# EAGLE design DAU_Kupplung.brd_V1_6 (EAGLE 5.11)
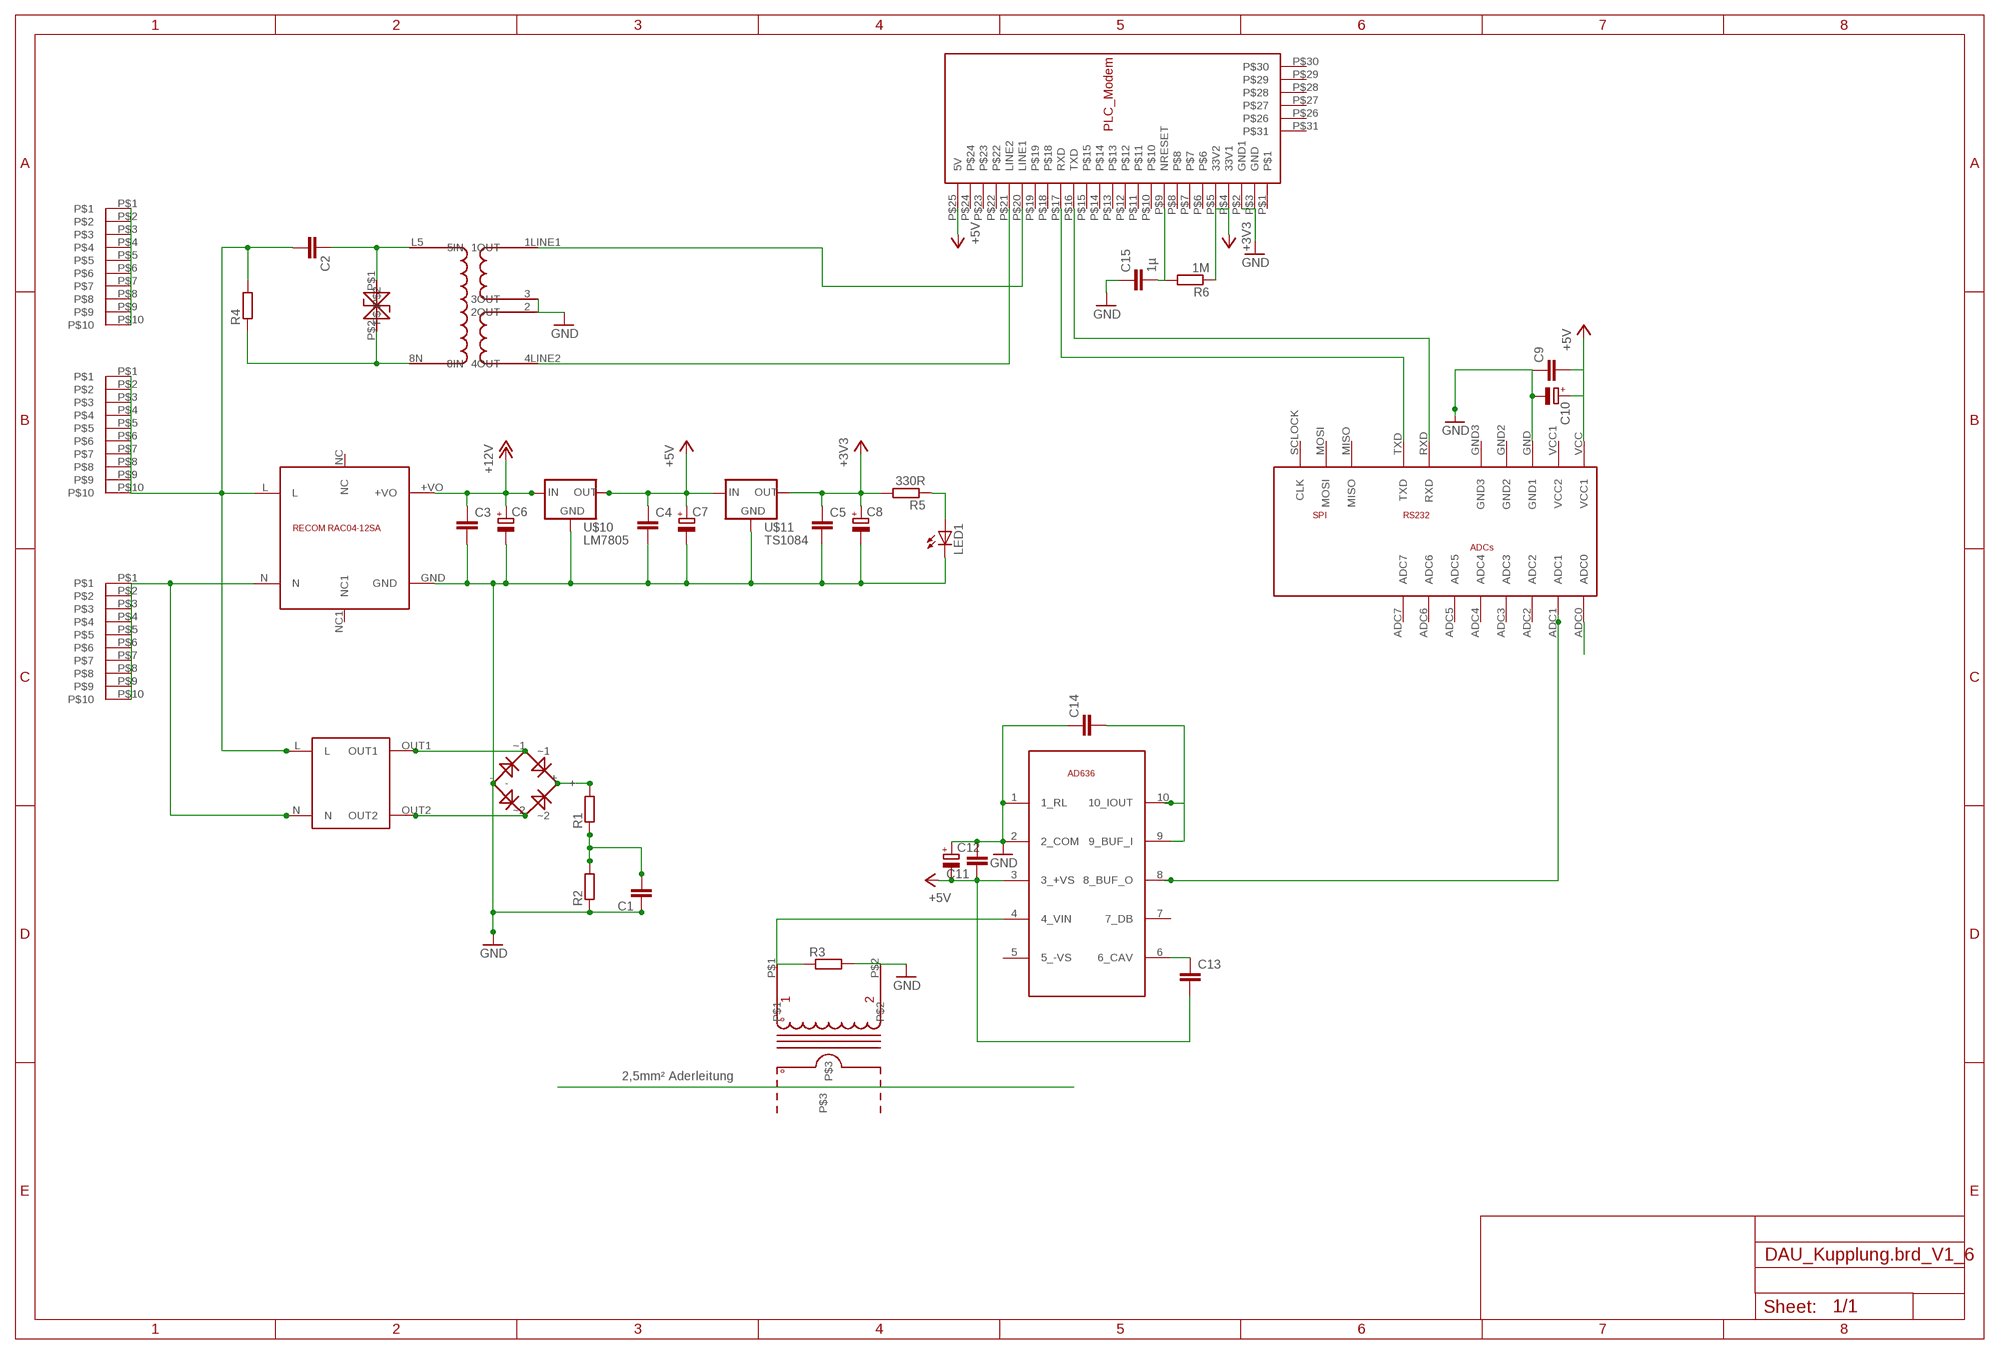
[diagram p0: schematic, sheet 1]

## Parts
C1  C2,5-3  [C2.5-3]
C2  C-EU225-087X268  [C225-087X268]
C3  C-EU025-040X050  [C025-040X050]
C4  C-EU025-040X050  [C025-040X050]
C5  C-EU025-040X050  [C025-040X050]
C6  CPOL-EUE2.5-6  [E2,5-6]
C7  CPOL-EUE2.5-6  [E2,5-6]
C8  CPOL-EUE2.5-6  [E2,5-6]
C9  C-EU025-040X050  [C025-040X050]
C10  CPOL-EUE2,5-6E  [E2,5-6E]
C11  C-EU025-040X050  [C025-040X050]
C12  CPOL-EUE2,5-6E  [E2,5-6E]
C13  C-EU025-040X050  [C025-040X050]
C14  C-EU025-040X050  [C025-040X050]
C15  1µ  C-EU025-040X050  [C025-040X050]
L  PRINT_CONNECTOR  [FASTON_DOUBLE]
LED1  LEDSQR2X5  [LED2X5]
N  PRINT_CONNECTOR  [FASTON_DOUBLE]
PE  PRINT_CONNECTOR  [FASTON_DOUBLE]
R1  R-EU_0204/7  [0204/7]
R2  R-EU_0204/7  [0204/7]
R3  R-EU_0204/7  [0204/7]
R4  R-EU_0204/7  [0204/7]
R5  330R  R-EU_0204/7  [0204/7]
R6  1M  R-EU_0204/7  [0204/7]
U$1  RECOM_RAC04_12SA  [RAC04_12SA]
U$2  SICHERHEITSTRAFO  [TRAFO_0,35VA]
U$3  ADUC831_MINIMUM  [ADUC_MINIMUM]
U$4  MODEMSTECKER  [MODEM_FUSS]
U$5  PLC_UEBERTRAGER_V2  [PLC-UEBERTRAGER_V2]
U$6  AC1010  [AC1010]
U$7  AD636  [TO100_10PIN]
U$8  RECTIFIER  [RECTIFIER]
U$9  SUPPRESSORDIODE15MM  [DIODE15_5MM]
U$10  LM7805  [LM7805]
U$11  TS1084  [TS1084]

## Nets
+3V3: C5.1 C8.+ R5.2 R6.1 U$4.P$4(33V1) U$4.P$5(33V2) U$11.2OUT(OUT)
+5V: C4.1 C7.+ C9.2 C10.+ C11.1 C12.- C13.2 U$3.VCC(VCC1) U$4.P$25(5V) U$7.3(3_+VS) U$10.OUT U$11.3IN(IN)
+12V: C3.1 C6.+ U$1.+VO U$10.IN
GND: C1.1 C3.2 C4.2 C5.2 C6.- C7.- C8.- C9.1 C10.- C11.2 C12.+ C14.1 C15.1 LED1.K(C) R2.1 R3.2 U$1.GND U$3.GND(GND1) U$4.P$2(GND1) U$4.P$3(GND) U$5.2(2OUT) U$5.3(3OUT) U$6.P$2 U$7.1(1_RL) U$7.2(2_COM) U$8.- U$10.GND U$11.1GND(GND)
N$2: R4.1 U$5.8N(8IN) U$9.P$2
N$3: U$2.OUT1 U$8.~1
N$4: U$2.OUT2 U$8.~2
N$5: U$4.P$20(LINE1) U$5.1LINE1(1OUT)
N$6: C1.2 R1.1 R2.2 U$3.ADC0
N$7: R1.2 U$8.+
N$8: R3.1 U$6.P$1 U$7.4(4_VIN)
N$10: N.P$1 N.P$2 N.P$3 N.P$4 N.P$5 N.P$6 N.P$7 N.P$8 N.P$9 N.P$10 U$1.N U$2.N
N$11: C2.1 U$5.L5(5IN) U$9.P$1
N$12: C2.2 L.P$1 L.P$2 L.P$3 L.P$4 L.P$5 L.P$6 L.P$7 L.P$8 L.P$9 L.P$10 R4.2 U$1.L U$2.L
N$13: U$4.P$21(LINE2) U$5.4LINE2(4OUT)
N$14: U$3.RXD U$4.P$16(TXD)
N$15: U$3.TXD U$4.P$17(RXD)
N$16: C14.2 U$7.9(9_BUF_I) U$7.10(10_IOUT)
N$17: C13.1 U$7.6(6_CAV)
N$18: U$3.ADC1 U$7.8(8_BUF_O)
N$19: LED1.A R5.1
N$20: C15.2 R6.2 U$4.P$9(NRESET)
N$22: PE.P$1 PE.P$2 PE.P$3 PE.P$4 PE.P$5 PE.P$6 PE.P$7 PE.P$8 PE.P$9 PE.P$10
Unconnected: U$1.NC U$1.NC1 U$3.ADC2 U$3.ADC3 U$3.ADC4 U$3.ADC5 U$3.ADC6 U$3.ADC7 U$3.GND2 U$3.GND3 U$3.MISO U$3.MOSI U$3.SCLOCK(CLK) U$3.VCC1(VCC2) U$4.P$1 U$4.P$6 U$4.P$7 U$4.P$8 U$4.P$10 U$4.P$11 U$4.P$12 U$4.P$13 U$4.P$14 U$4.P$15 U$4.P$18 U$4.P$19 U$4.P$22 U$4.P$23 U$4.P$24 U$4.P$26 U$4.P$27 U$4.P$28 U$4.P$29 U$4.P$30 U$4.P$31 U$6.P$3 U$7.5(5_-VS) U$7.7(7_DB)

## Notes on the sheet
- 2,5mm² Aderleitung

## Library data of the parts
C1 = capacitor-wima:C: CAPACITOR naming: grid - package width
C2-C5 C15 = resistor:C-EU: CAPACITOR, European symbol
C6-C8 = resistor:CPOL-EU: POLARIZED CAPACITOR, European symbol
C9 C11 C13 C14 = rcl:C-EU: CAPACITOR, European symbol
C10 C12 = rcl:CPOL-EU: POLARIZED CAPACITOR, European symbol
L N PE = ADS:PRINT_CONNECTOR
LED1 = led:LED: LED OSRAM: - CHIPLED LG R971, LG N971, LY N971, LG Q971, LY Q971, LO R971, LY R971 LH N974, LH R974 LS Q976, LO Q976, LY Q976 LO Q996 - Hyper CHIPLED LW Q18S LB Q993, LB Q99A, LB R99A - SideLED LS A670, LO A670, LY A670, LG A670, LP A670 LB A673, LV A673, LT A673, LW A673 LH A674 LY A675 LS A676, LA A676, LO A676, LY A676, LW A676 LS A679, LY A679, LG A679 - Hyper Micro SIDELED® LS Y876, LA Y876, LO Y876, LY Y876 LT Y87S - SmartLED LW L88C, LW L88S LB L89C, LB L89S, LG L890 LS L89K, LO L89K, LY L89K LS L896, LA L896, LO L896, LY L896 - TOPLED LS T670, LO T670, LY T670, LG T670, LP T670 LSG T670, LSP T670, LSY T670, LOP T670, LYG T670 LG T671, LOG T671, LSG T671 LB T673, LV T673, LT T673, LW T673 LH T674 LS T676, LA T676, LO T676, LY T676, LB T676, LH T676, LSB T676, LW T676 LB T67C, LV T67C, LT T67C, LS T67K, LO T67K, LY T67K, LW E67C LS E67B, LA E67B, LO E67B, LY E67B, LB E67C, LV E67C, LT E67C LW T67C LS T679, LY T679, LG T679 LS T770, LO T770, LY T770, LG T770, LP T770 LB T773, LV T773, LT T773, LW T773 LH T774 LS E675, LA E675, LY E675, LS T675 LS T776, LA T776, LO T776, LY T776, LB T776 LHGB T686 LT T68C, LB T68C - Hyper Mini TOPLED® LB M676 - Mini TOPLED Santana® LG M470 LS M47K, LO M47K, LY M47K Source: http://www.osram.convergy.de LUXEON: - LUMILED® LXK2-PW12-R00, LXK2-PW12-S00, LXK2-PW14-U00, LXK2-PW14-V00 LXK2-PM12-R00, LXK2-PM12-S00, LXK2-PM14-U00 LXK2-PE12-Q00, LXK2-PE12-R00, LXK2-PE12-S00, LXK2-PE14-T00, LXK2-PE14-U00 LXK2-PB12-K00, LXK2-PB12-L00, LXK2-PB12-M00, LXK2-PB14-N00, LXK2-PB14-P00, LXK2-PB14-Q00 LXK2-PR12-L00, LXK2-PR12-M00, LXK2-PR14-Q00, LXK2-PR14-R00 LXK2-PD12-Q00, LXK2-PD12-R00, LXK2-PD12-S00 LXK2-PH12-R00, LXK2-PH12-S00 LXK2-PL12-P00, LXK2-PL12-Q00, LXK2-PL12-R00 Source: www.luxeon.com KINGBRIGHT: KA-3528ASYC Source: www.kingbright.com
R1-R6 = resistor:R-EU_: RESISTOR, European symbol
U$1 = ADS:RECOM_RAC04_12SA
U$2 = ADS:SICHERHEITSTRAFO
U$3 = ADS_ADUCBoards:ADUC831_MINIMUM
U$4 = ADS:MODEMSTECKER
U$5 = ADS1:PLC_UEBERTRAGER_V2
U$6 = ADS:AC1010
U$7 = ADS:AD636
U$8 = ADS:RECTIFIER
U$9 = ADS:SUPPRESSORDIODE15MM
U$10 = ADS:LM7805
U$11 = ADS1:TS1084

## Board
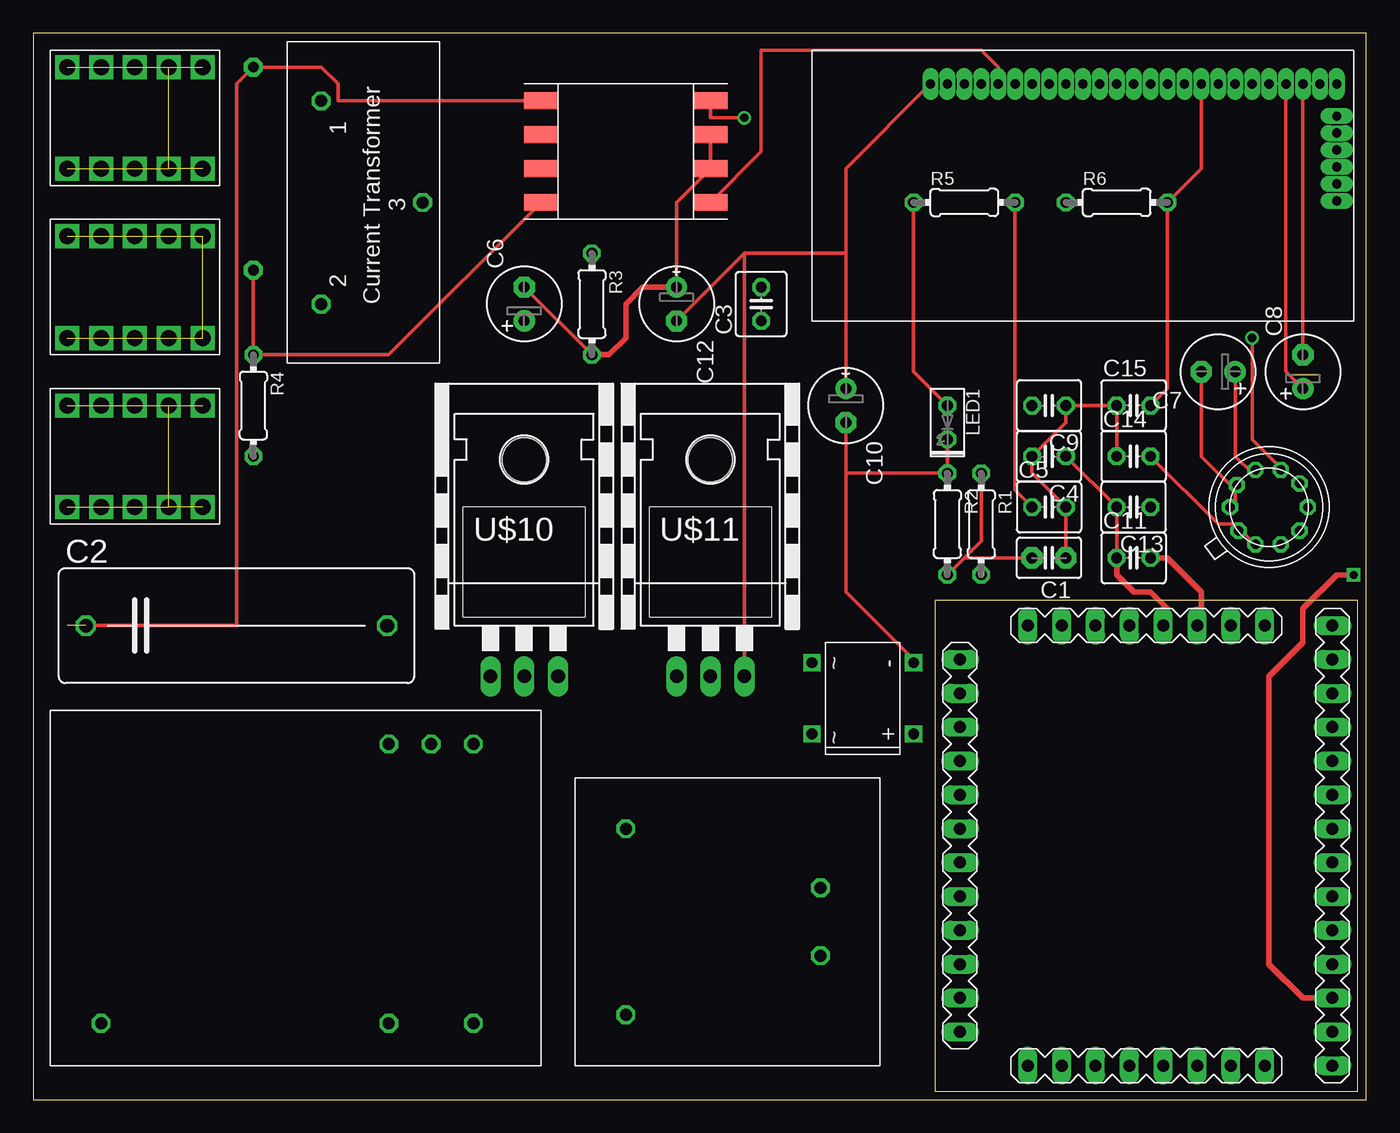
[diagram p1: board, top side]
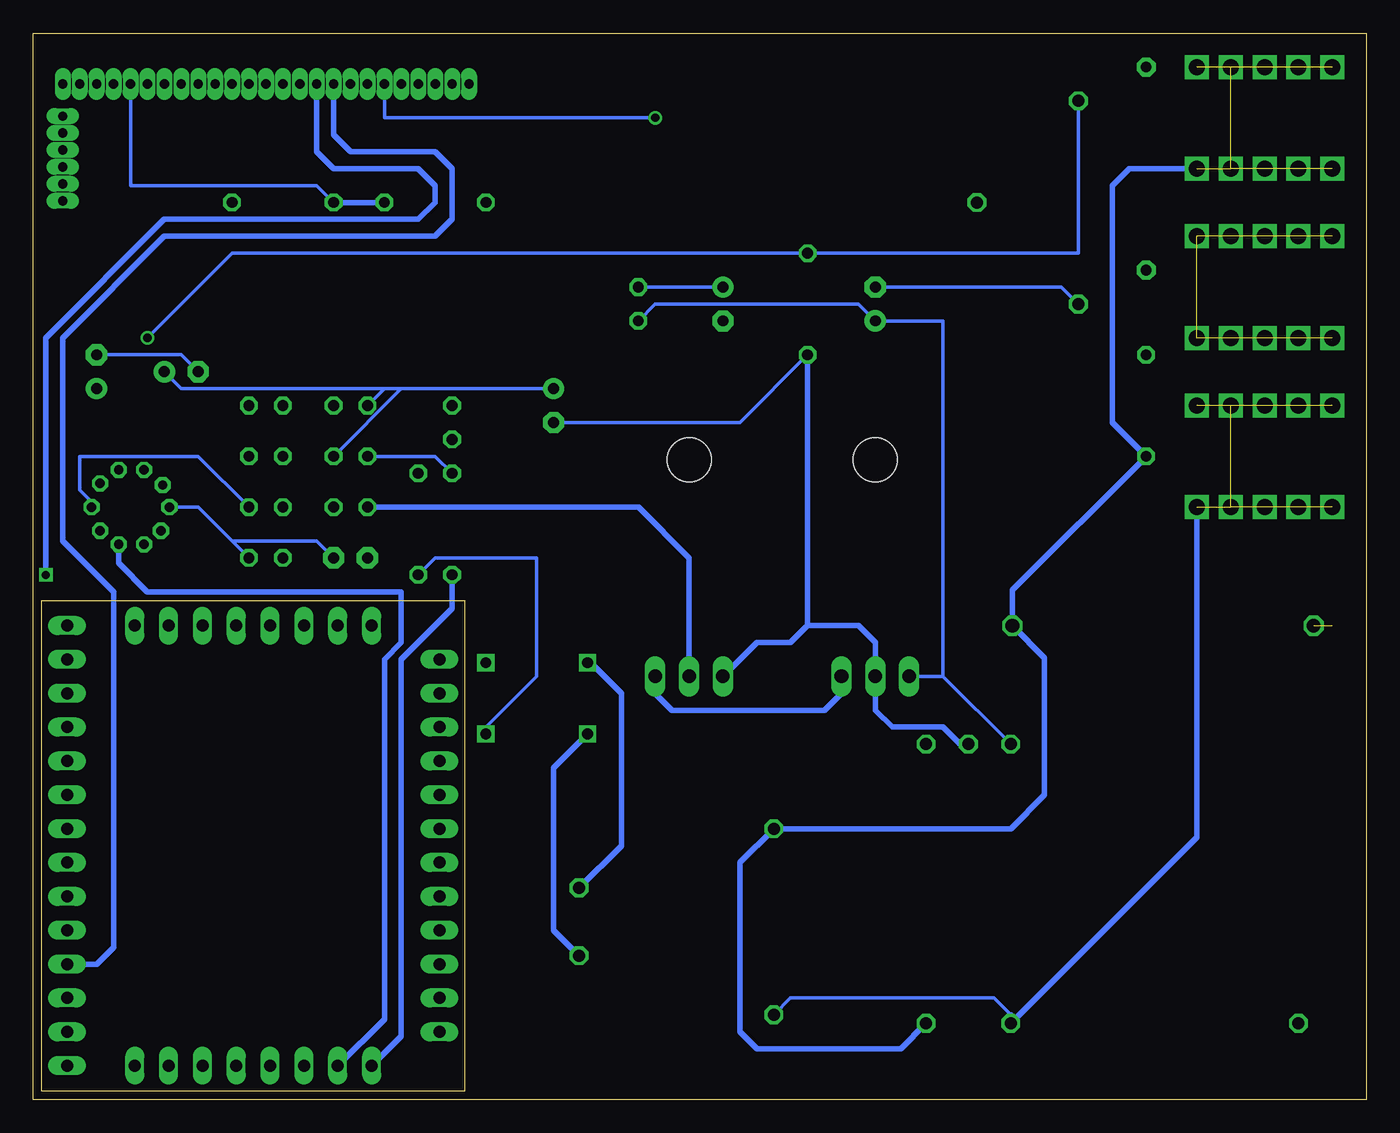
[diagram p2: board, bottom side, seen from below]

Size 100 x 80 mm. Coordinates in mm from the lower left corner, seen from the top.
Outline: 0,0 100,0 100,80 0,80 0,0
Copper layers (1*16): Top 0.035mm / dielectric 1.5mm / Bottom 0.035mm
Design rules "default": minimum track width 10mil, minimum drill 24mil, track to track 8mil, track to pad 8mil, pad to pad 8mil, via to via 8mil, smd to smd 8mil, copper to edge 40mil, drill to drill 8mil, minimum pad ring 10mil, minimum via ring 8mil, stop-mask expansion 4mil, vias tented up to drill 0mil, thermal gap 10mil

### Footprints (pad centres in the part's own frame; a part is rotated, then mirrored left to right if it is on the bottom)
C2.5-3 = drill 0.813 pad 1.6 octagon: 1 -1.27,0; 2 1.27,0
C225-087X268 = drill 1.016 octagon: 1 -11.303,0; 2 11.303,0
C025-040X050 = drill 0.813 octagon: 1 -1.27,0; 2 1.27,0
E2,5-6 = drill 0.813 pad 1.6 round: + -1.27,0 | drill 0.813 pad 1.6 octagon: - 1.27,0
E2,5-6E = drill 0.813 pad 1.575 round: + -1.27,0 | drill 0.813 pad 1.575 octagon: - 1.27,0
FASTON_DOUBLE = drill 1.2 square: P$1 -5.08,-3.81; P$2 -2.54,-3.81; P$3 -5.08,3.81; P$4 -2.54,3.81; P$5 0,3.81; P$6 2.54,3.81; P$7 5.08,3.81; P$8 0,-3.81; P$9 2.54,-3.81; P$10 5.08,-3.81
LED2X5 = drill 0.813 octagon: A -1.27,0; K 1.27,0
0204/7 = drill 0.813 octagon: 1 -3.81,0; 2 3.81,0
RAC04_12SA = drill 0.9 octagon: +VO 25.4,24.13; GND 28.575,24.13; L 31.75,3.175; N 25.4,3.175; NC 3.81,3.175; NC1 31.75,24.13
TRAFO_0,35VA = drill 0.9 octagon: L 3.81,17.78; N 3.81,3.81; OUT1 18.415,13.335; OUT2 18.415,8.255
ADUC_MINIMUM = drill 0.9 long: ADC0 -9.207,-16.51; ADC1 -6.668,-16.51; ADC2 -4.128,-16.51; ADC3 -1.587,-16.51; ADC4 6.032,-16.51; ADC5 8.572,-16.51; ADC6 13.652,-16.51; ADC7 13.652,-13.97; ALE -14.287,6.35; DAC0 0.953,-16.51; DAC1 3.493,-16.51; GND 3.493,16.51; GND2 -4.128,16.51; GND3 -6.668,16.51; INT0 13.652,-6.35; MISO 13.652,-3.81; MOSI 13.652,11.43; P00 -14.287,3.81; P01 -14.287,1.27; P02 -14.287,-1.27; P03 -14.287,-3.81; P04 -14.287,-6.35; P05 -14.287,-8.89; P06 -14.287,-11.43; P07 -14.287,-13.97; P20 13.652,13.97; P21 13.652,16.51; P22 8.572,16.51; P23 6.032,16.51; P24 -9.207,16.51; P25 -14.287,13.97; P34 13.652,-1.27; P35 13.652,1.27; P36 13.652,3.81; P37 13.652,6.35; PWM0 -14.287,11.43; PWM1 -14.287,8.89; RXD 13.652,-11.43; SCLOCK 13.652,8.89; TXD 13.652,-8.89; VCC 0.953,16.51; VCC1 -1.587,16.51
MODEM_FUSS = drill 0.7 pad 0.813 long: P$1 -20.32,-8.89; P$2 -19.05,-8.89; P$3 -17.78,-8.89; P$4 -16.51,-8.89; P$5 -15.24,-8.89; P$6 -13.97,-8.89; P$7 -12.7,-8.89; P$8 -11.43,-8.89; P$9 -10.16,-8.89; P$10 -8.89,-8.89; P$11 -7.62,-8.89; P$12 -6.35,-8.89; P$13 -5.08,-8.89; P$14 -3.81,-8.89; P$15 -2.54,-8.89; P$16 -1.27,-8.89; P$17 0,-8.89; P$18 1.27,-8.89; P$19 2.54,-8.89; P$20 3.81,-8.89; P$21 5.08,-8.89; P$22 6.35,-8.89; P$23 7.62,-8.89; P$24 8.89,-8.89; P$25 10.16,-8.89; P$29 -20.32,-3.937; P$30 -20.32,-5.207; P$31 -20.32,-6.477 | drill 0.7 pad 0.61 long: P$26 -20.32,-0.127; P$27 -20.32,-1.397; P$28 -20.32,-2.667
PLC-UEBERTRAGER_V2 = smd 2.54 x 1.27: 1LINE1 6.35,3.81; 2 6.35,1.27; 3 6.35,-1.27; 4LINE2 6.35,-3.81; 6NC -6.35,1.27; 7NC -6.35,-1.27; 8N -6.35,-3.81; L5 -6.35,3.81
AC1010 = drill 0.9 octagon: P$1 20.32,8.89; P$2 5.08,8.89; P$3 12.7,1.27
TO100_10PIN = drill 0.7 octagon: 1 0,-2.921; 2 -1.651,-2.413; 3 -2.794,-1.016; 4 -2.794,0.889; 5 -1.778,2.286; 6 0,2.921; 7 1.778,2.286; 8 2.794,0.889; 9 2.794,-1.016; 10 1.778,-2.286
RECTIFIER = drill 0.8 square: + 6.858,7.62; - 1.524,7.62; ~1 1.524,0; ~2 6.858,0
DIODE15_5MM = drill 0.8 pad 1.422 octagon: P$1 0,0; P$2 15.24,0
LM7805 = drill 1.016 long: GND 7.62,-3.81; IN 5.08,-3.81; OUT 10.16,-3.81 | hole 3.302: 7.62,12.446
TS1084 = drill 1.016 long: 1GND 5.08,1.27; 2OUT 7.62,1.27; 3IN 10.16,1.27 | hole 3.302: 7.62,17.526

### Placement (x,y rotation side)
C1  76.2,40.64 180 top
C2  15.24,35.56 0 top
C3  54.61,59.69 90 top
C4  76.2,48.26 180 top
C5  76.2,44.45 0 top
C6  36.83,59.69 90 top
C7  88.9,54.61 180 top
C8  95.25,54.61 90 top
C9  76.2,52.07 180 top
C10  60.96,52.07 270 top
C11  82.55,40.64 0 top
C12  48.26,59.69 270 top
C13  82.55,44.45 180 top
C14  82.55,48.26 0 top
C15  82.55,52.07 0 top
L  7.62,73.66 180 top
LED1  68.58,50.8 270 top
N  7.62,48.26 0 top
PE  7.62,60.96 0 top
R1  71.12,43.18 270 top
R2  68.58,43.18 270 top
R3  41.91,59.69 270 top
R4  16.51,52.07 270 top
R5  69.85,67.31 0 top
R6  81.28,67.31 0 top
U$1  1.27,2.54 0 top
U$2  40.64,2.54 0 top
U$3  83.82,19.05 0 top
U$4  77.47,67.31 180 top
U$5  44.45,71.12 0 top
U$6  30.48,54.61 90 top
U$7  92.71,44.45 270 top
U$8  58.42,34.29 270 top
U$9  16.51,77.47 270 top
U$10  29.21,35.56 0 top
U$11  43.18,30.48 0 top

### Tracks (layer width: path | path; a pad name or v marks a point on that pad's centre or on a via)
+3V3
  Top 0.254: U$4.P$5 U$4.P$4 93.98,54.61 C8.+ | C5.1 73.66,45.72 R5.2
  Bottom 0.254: U$4.P$5 92.71,68.58 78.74,68.58 R6.1
  Bottom 0.406: R5.2 R6.1 | U$11.2OUT 50.8,40.64 54.61,44.45 60.96,44.45 62.23,44.45 C5.1
+5V
  Top 0.254: C11.1 C13.2 C4.1 | C7.+ 90.17,48.26 91.44,46.99 U$7.3 | U$4.P$25 60.96,69.85 60.96,63.5 | 60.96,63.5 C10.+ | 53.34,63.5 C12.- | 53.34,63.5 60.96,63.5 | U$11.3IN 53.34,63.5
  Top 0.406: U$3.VCC 85.09,35.88 85.09,36.83 83.82,38.1 82.55,38.1 81.28,39.37 C11.1
  Bottom 0.254: 73.66,53.34 C9.2 | C10.+ 72.39,53.34 | 72.39,53.34 73.66,53.34 | C7.+ 88.9,53.34 73.66,53.34 | 72.39,53.34 C4.1
  Bottom 0.406: U$11.3IN 53.34,30.48 52.07,29.21 40.64,29.21 39.37,30.48 U$10.OUT
+12V
  Bottom 0.254: U$1.+VO 31.75,31.75 | 31.75,31.75 U$10.IN | C3.1 53.34,59.69 38.1,59.69 C6.+ 31.75,58.42 31.75,31.75
GND
  Top 0.254: U$5.2 U$5.3 48.26,67.31 C12.+ | R3.2 C6.- | C10.- 60.96,46.99 | 60.96,46.99 60.96,38.1 66.04,33.02 U$8.- | C1.1 C5.2 74.93,46.99 C4.2 77.47,50.8 C9.1 C15.1 C14.1 | LED1.K R2.1 60.96,46.99 | 90.17,45.72 90.17,44.45 U$7.1 | U$4.P$2 U$4.P$3 C8.- | 90.17,45.72 87.63,48.26 C7.- | 90.17,45.72 U$7.2
  Top 0.406: U$3.GND 87.63,35.88 87.63,38.1 85.09,40.64 C11.2 | R3.2 43.18,55.88 44.45,57.15 44.45,59.69 45.72,60.96 C12.+
  Bottom 0.254: C12.+ C3.2 | U$6.P$2 22.86,60.96 C6.- | R2.1 69.85,48.26 C4.2 | 85.09,41.91 87.63,44.45 U$7.1 90.17,44.45 | 85.09,41.91 C11.2 | C7.- 88.9,55.88 C8.- | C1.1 78.74,41.91 85.09,41.91 | R3.2 46.99,50.8 C10.-
  Bottom 0.406: U$1.GND 30.48,26.67 31.75,27.94 35.56,27.94 36.83,29.21 U$10.GND 36.83,34.29 38.1,35.56 41.91,35.56 | U$11.1GND 45.72,34.29 43.18,34.29 41.91,35.56 | 41.91,35.56 R3.2
N$2
  Top 0.254: U$5.8N 26.67,55.88 R4.1 U$9.P$2
N$3
  Bottom 0.406: U$2.OUT1 55.88,19.05 55.88,30.48 58.17,32.77 U$8.~1
N$4
  Bottom 0.406: U$2.OUT2 60.96,12.7 60.96,24.89 U$8.~2
N$5  (via drill 0.61)
  Top 0.254: v53.34,73.66 50.8,73.66 U$5.1LINE1
  Bottom 0.254: U$4.P$20 73.66,73.66 v53.34,73.66
N$6
  Top 0.254: 69.85,40.64 71.12,41.91 R1.1 | R2.2 69.85,40.64 | 69.85,40.64 C1.2
  Bottom 0.406: U$3.ADC0 72.39,4.76 72.39,33.02 68.58,36.83 R2.2
N$7
  Bottom 0.254: R1.2 69.85,40.64 62.23,40.64 62.23,31.75 66.04,27.94 U$8.+
N$8  (via drill 0.61)
  Top 0.254: v91.44,57.15 91.44,49.53 93.98,46.99 U$7.4
  Bottom 0.254: v91.44,57.15 85.09,63.5 R3.1 21.59,63.5 U$6.P$1
N$10  (9 unrouted)
  Bottom 0.254: 26.67,6.35 27.94,7.62 43.18,7.62 U$2.N
  Bottom 0.406: 26.67,6.35 U$1.N 12.7,19.68 N.P$10
N$11  (1 unrouted)
  Top 0.254: U$5.L5 22.86,74.93 22.86,76.2 21.59,77.47 U$9.P$1 15.24,76.2 15.24,35.56 C2.1
N$12  (9 unrouted)
  Bottom 0.406: L.P$3 17.78,69.85 19.05,68.58 19.05,50.8 R4.2 26.54,38.23 C2.2 24.13,33.15 24.13,22.86 26.67,20.32 U$2.L 46.99,17.78 46.99,5.08 45.72,3.81 34.92,3.81 U$1.L
N$13
  Top 0.254: U$4.P$21 72.39,77.47 71.12,78.74 54.61,78.74 54.61,71.12 U$5.4LINE2
N$14  (via drill 0.6)
  Top 0.406: U$3.RXD 95.25,7.62 92.71,10.16 92.71,31.75 95.25,34.29 95.25,36.83 97.79,39.37 v99.06,39.37
  Bottom 0.406: v99.06,39.37 99.06,57.15 90.17,66.04 71.12,66.04 69.85,67.31 69.85,68.58 71.12,69.85 77.47,69.85 78.74,71.12 U$4.P$16
N$15
  Bottom 0.406: U$4.P$17 77.47,72.39 76.2,71.12 69.85,71.12 68.58,69.85 68.58,66.04 69.85,64.77 90.17,64.77 97.79,57.15 97.79,41.91 93.98,38.1 93.98,11.43 95.25,10.16 U$3.TXD
N$16
  Top 0.254: 90.17,43.18 U$7.9 | C14.2 88.9,43.18 90.17,43.18 | U$7.10 90.17,43.18
N$17
  Bottom 0.254: C13.1 87.63,48.26 96.52,48.26 96.52,45.72 95.25,44.45 U$7.6
N$18
  Bottom 0.406: U$3.ADC1 73.66,6.03 73.66,33.02 72.39,34.29 72.39,38.1 91.44,38.1 93.6,40.26 U$7.8
N$19
  Top 0.254: LED1.A 66.04,54.61 R5.1
N$20
  Top 0.254: U$4.P$9 87.63,69.85 R6.2 85.09,53.34 C15.2
N$21  (via drill 0.6)
  other vias: 99.06,39.37
N$22  (9 unrouted)